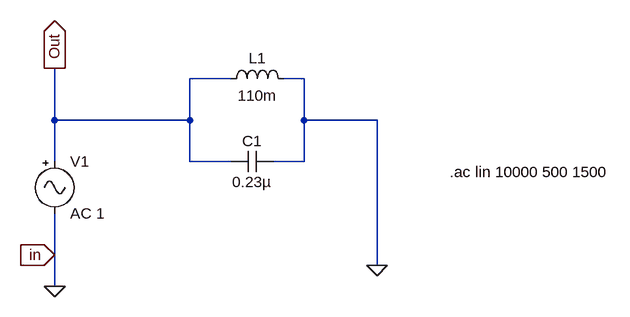
[diagram p0: schematic Notch_Filter_1k.asc]
Notch_Filter_1k.asc, the LTspice schematic file:
Version 4.1
SHEET 1 892 680
WIRE 288 176 224 176
WIRE 400 176 368 176
WIRE 16 240 16 160
WIRE 224 240 224 176
WIRE 224 240 16 240
WIRE 400 240 400 176
WIRE 512 240 400 240
WIRE 16 304 16 240
WIRE 224 304 224 240
WIRE 288 304 224 304
WIRE 400 304 400 240
WIRE 400 304 352 304
WIRE 16 448 16 384
WIRE 512 464 512 240
WIRE 16 496 16 448
FLAG 16 496 0
FLAG 512 464 0
FLAG 16 448 in
IOPIN 16 448 In
FLAG 16 160 Out
IOPIN 16 160 Out
SYMBOL ind 272 192 R270
WINDOW 0 32 56 VTop 2
WINDOW 3 5 56 VBottom 2
SYMATTR InstName L1
SYMATTR Value 110m
SYMATTR SpiceLine Rser=20
SYMBOL cap 288 320 R270
WINDOW 0 32 32 VTop 2
WINDOW 3 0 32 VBottom 2
SYMATTR InstName C1
SYMATTR Value 0.23µ
SYMBOL Misc\\signal 16 288 R0
SYMATTR InstName V1
SYMATTR Value AC 1
TEXT 624 320 Left 2 !.ac lin 10000 500 1500

The netlist it stands for:
* Notch_Filter_1k.asc
L1 Out 0 110m Rser=20
C1 Out 0 0.23µ
V1 Out 0 AC 1
.ac lin 10000 500 1500
.backanno
.end